# EAGLE design Power Distribution (EAGLE 8.3.2)
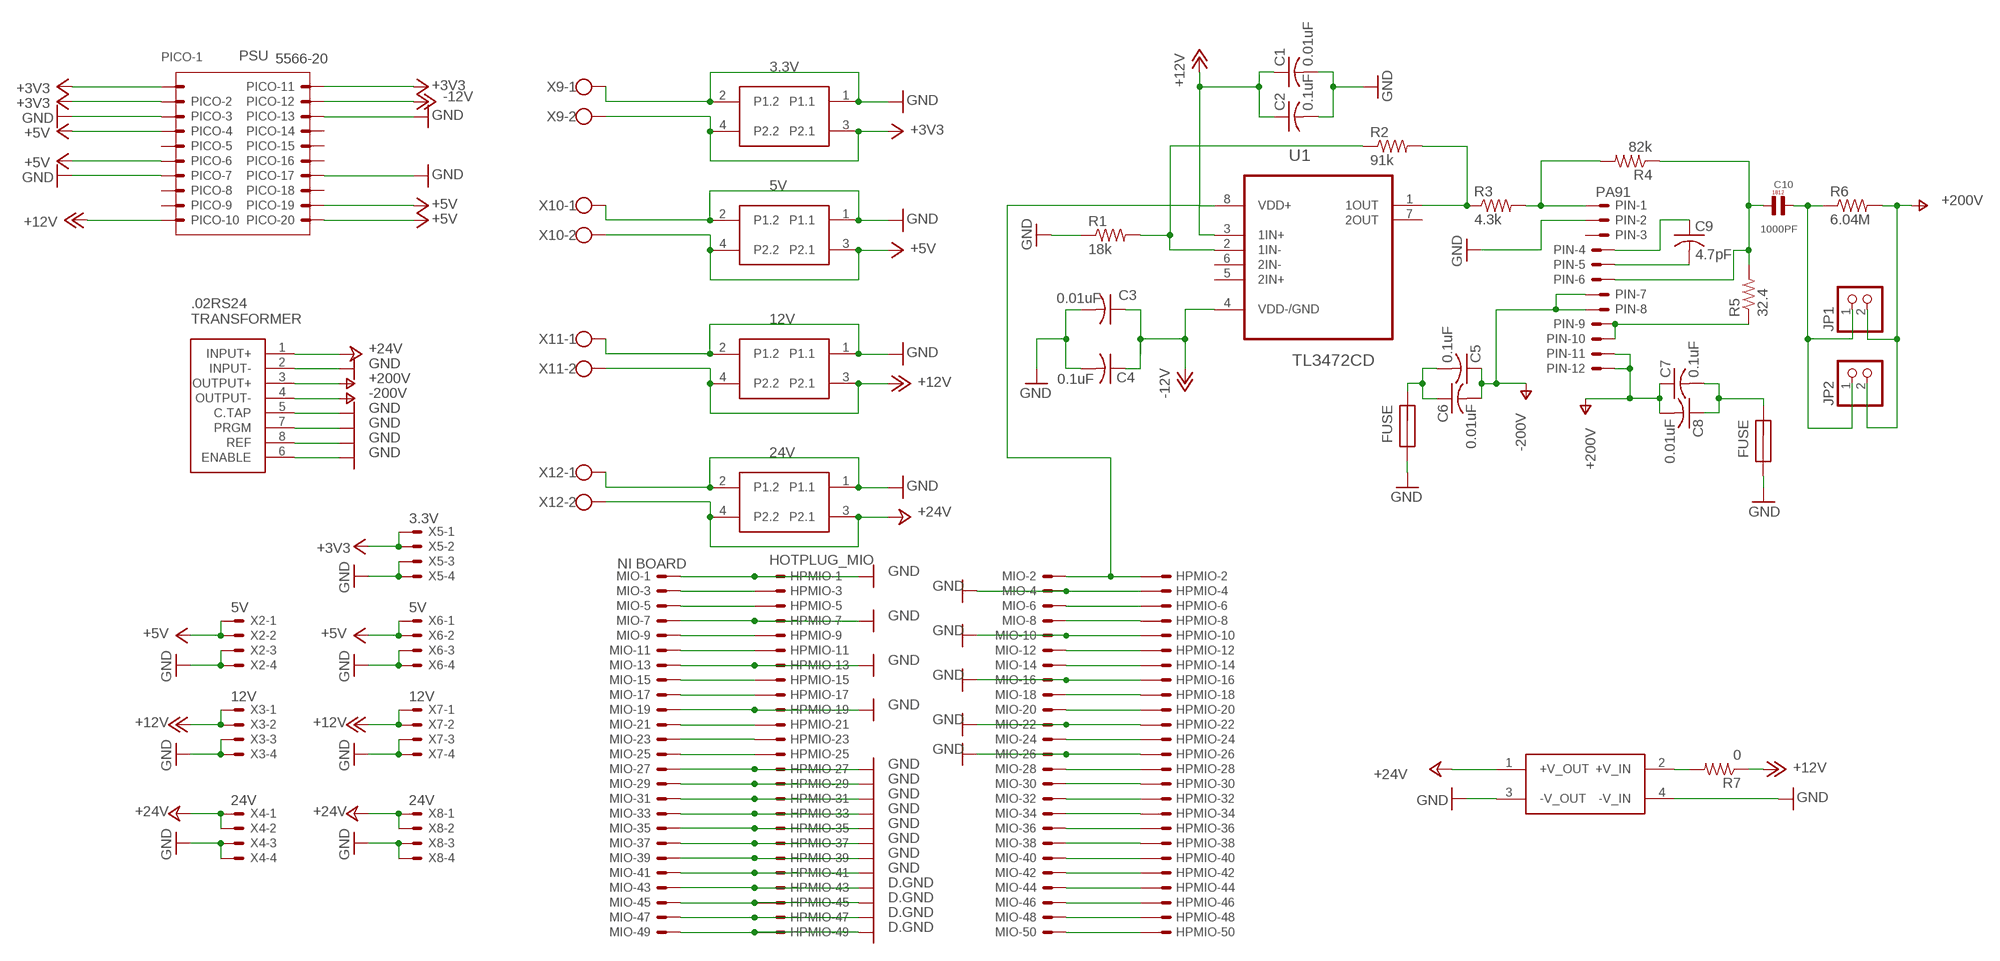
[diagram p0: schematic, sheet 1]

## Parts
$ZX1  12_DC-24_DC  [12_DC-24_DC]
C1  0.01uF  C-USC1206  [C1206]
C2  0.1uF  C-USC1206  [C1206]
C3  0.01uF  C-USC1206  [C1206]
C4  0.1uF  C-USC1206  [C1206]
C5  0.1uF  C-USC1206  [C1206]
C6  0.01uF  C-USC1206  [C1206]
C7  0.1uF  C-USC1206  [C1206]
C8  0.01uF  C-USC1206  [C1206]
C9  4.7pF  C-USC1206  [C1206]
C10  1000PF  [L4,8]
HPMIO  HOTPLUG_MIO  057-050-1  [057-050-1]
JP1  PINHD-1X2  [1X02]
JP2  PINHD-1X2  [1X02]
MIO  87758-5016  [87758-5016]
PICO  5566-20  [5566-20]
PIN  PA91  22-23-2121  [22-23-2121]
R1  18k  R-US_R1206  [R1206]
R2  91k  R-US_R1206  [R1206]
R3  4.3k  R-US_R1206  [R1206]
R4  82k  R-US_R1206  [R1206]
R5  32.4  R-US_R1206  [R1206]
R6  6.04M  R-US_R1206  [R1206]
R7  0  R-US_R1206  [R1206]
U1  TL3472CD  [SOIC127P600X175-8N]
U$1  .2RS24_TRANSFORMER  [0.2RS24_TRANSFORMER]
U$2  UXCELL_BLOCK_TERMINAL_RIGHT_ANGLE  [UXCELL_BLOCK_TERMINAL_RIGHT_ANGLE]
U$3  UXCELL_BLOCK_TERMINAL_RIGHT_ANGLE  [UXCELL_BLOCK_TERMINAL_RIGHT_ANGLE]
U$4  UXCELL_BLOCK_TERMINAL_RIGHT_ANGLE  [UXCELL_BLOCK_TERMINAL_RIGHT_ANGLE]
U$5  UXCELL_BLOCK_TERMINAL_RIGHT_ANGLE  [UXCELL_BLOCK_TERMINAL_RIGHT_ANGLE]
U$6  FUSE  [FUSE]
U$7  FUSE  [FUSE]
X2  5V  JST-XH-04-PIN-LONG-PAD  [JST-XH-04-PACKAGE-LONG-PAD]
X3  12V  JST-XH-04-PIN-LONG-PAD  [JST-XH-04-PACKAGE-LONG-PAD]
X4  24V  JST-XH-04-PIN-LONG-PAD  [JST-XH-04-PACKAGE-LONG-PAD]
X5  3.3V  JST-XH-04-PIN-LONG-PAD  [JST-XH-04-PACKAGE-LONG-PAD]
X6  5V  JST-XH-04-PIN-LONG-PAD  [JST-XH-04-PACKAGE-LONG-PAD]
X7  12V  JST-XH-04-PIN-LONG-PAD  [JST-XH-04-PACKAGE-LONG-PAD]
X8  24V  JST-XH-04-PIN-LONG-PAD  [JST-XH-04-PACKAGE-LONG-PAD]
X9  W237-102  [W237-102]
X10  W237-102  [W237-102]
X11  W237-102  [W237-102]
X12  W237-102  [W237-102]

## Nets
+3V3: PICO.1 PICO.2 PICO.11 U$5.3(P2.1) U$5.4(P2.2) X5.1 X5.2 X9.2
+5V: PICO.4 PICO.6 PICO.19 PICO.20 U$2.3(P2.1) U$2.4(P2.2) X2.1 X2.2 X6.1 X6.2 X10.2
+12V: C1.1 C2.1 PICO.10 R7.1 U1.8(VDD+) U$3.3(P2.1) U$3.4(P2.2) X3.1 X3.2 X7.1 X7.2 X11.2
+24V: $ZX1.1(+V_OUT) U$1.1(INPUT+) U$4.3(P2.1) U$4.4(P2.2) X4.1 X4.2 X8.1 X8.2 X12.2
-12V: C3.1 C4.1 PICO.12 U1.4(VDD-/GND)
GND: $ZX1.3(-V_OUT) $ZX1.4(-V_IN) C1.2 C2.2 C3.2 C4.2 HPMIO.1 HPMIO.4 HPMIO.7 HPMIO.10 HPMIO.13 HPMIO.16 HPMIO.19 HPMIO.22 HPMIO.26 HPMIO.27 HPMIO.29 HPMIO.31 HPMIO.33 HPMIO.35 HPMIO.37 HPMIO.39 HPMIO.41 HPMIO.43 HPMIO.45 HPMIO.47 HPMIO.49 MIO.1 MIO.4 MIO.7 MIO.10 MIO.13 MIO.16 MIO.19 MIO.22 MIO.26 MIO.27 MIO.29 MIO.31 MIO.33 MIO.35 MIO.37 MIO.39 MIO.41 MIO.43 MIO.45 MIO.47 MIO.49 PICO.3 PICO.7 PICO.13 PICO.17 PIN.2 R1.1 U$1.2(INPUT-) U$1.5(C.TAP) U$1.6(ENABLE) U$1.7(PRGM) U$1.8(REF) U$2.1(P1.1) U$2.2(P1.2) U$3.1(P1.1) U$3.2(P1.2) U$4.1(P1.1) U$4.2(P1.2) U$5.1(P1.1) U$5.2(P1.2) U$6.P$1 U$7.P$1 X2.3 X2.4 X3.3 X3.4 X4.3 X4.4 X5.3 X5.4 X6.3 X6.4 X7.3 X7.4 X8.3 X8.4 X9.1 X10.1 X11.1 X12.1 ; supply symbol labelled D.GND
N$1: $ZX1.2(+V_IN) R7.2
N$2: C5.2 C6.1 U$6.P$2
N$3: C7.2 C8.1 U$7.P$2
N$4: HPMIO.3 MIO.3
N$5: HPMIO.5 MIO.5
N$7: HPMIO.9 MIO.9
N$8: HPMIO.11 MIO.11
N$10: HPMIO.15 MIO.15
N$11: HPMIO.17 MIO.17
N$13: HPMIO.21 MIO.21
N$14: HPMIO.23 MIO.23
N$15: R1.2 R2.1 U1.2(1IN-)
N$21: R2.2 R3.1 U1.1(1OUT)
N$22: PIN.1 R3.2 R4.2
N$23: PIN.9 PIN.10 R5.1
N$24: C9.1 PIN.4
N$25: C9.2 PIN.5
N$26: C10.P$1 PIN.6 R4.1 R5.2
N$27: C10.P$2 JP1.1 JP2.1 R6.1
N$30: HPMIO.6 MIO.6
N$31: HPMIO.8 MIO.8
N$33: HPMIO.12 MIO.12
N$34: HPMIO.14 MIO.14
N$36: HPMIO.18 MIO.18
N$37: HPMIO.20 MIO.20
N$39: HPMIO.24 MIO.24
N$41: HPMIO.28 MIO.28
N$42: HPMIO.30 MIO.30
N$43: HPMIO.32 MIO.32
N$44: HPMIO.34 MIO.34
N$45: HPMIO.36 MIO.36
N$46: HPMIO.38 MIO.38
N$47: HPMIO.40 MIO.40
N$48: HPMIO.42 MIO.42
N$49: HPMIO.44 MIO.44
N$50: HPMIO.46 MIO.46
N$51: HPMIO.48 MIO.48
N$52: HPMIO.50 MIO.50
N$61: HPMIO.25 MIO.25
V+: C7.1 C8.2 JP1.2 JP2.2 PIN.11 PIN.12 R6.2 U$1.3(OUTPUT+) ; supply symbol labelled +200V
V-: C5.1 C6.2 PIN.7 PIN.8 U$1.4(OUTPUT-) ; supply symbol labelled -200V
VIN: HPMIO.2 MIO.2 U1.3(1IN+)
Unconnected: PICO.5 PICO.8 PICO.9 PICO.14 PICO.15 PICO.16 PICO.18 PIN.3 U1.5(2IN+) U1.6(2IN-) U1.7(2OUT)

## Notes on the sheet
- PSU
- 3.3V
- 5V
- 12V
- 24V
- NI BOARD

## Library data of the parts
$ZX1 = Lucas Library:12_DC-24_DC
C1 C3 C6 C8 = resistor:C-US: CAPACITOR, American symbol; MF: KEMET; MPN: C0805C103K1RACTU; OC_FARNELL: 1414661
C2 C4 C5 C7 = resistor:C-US: CAPACITOR, American symbol; MF: AVX; MPN: 08055C104KAT2A; OC_FARNELL: 499687
C9 = resistor:C-US: CAPACITOR, American symbol; MF: KEMET; MPN: C0805C479C5GACTU; OC_FARNELL: 1800809
C10 = Capacitor-Wima-SMD1812-250v:1000PF
HPMIO = con-panduit:057-050-: CONNECTOR 50-pin series 057 contact pc board low profile headers; OC_FARNELL: unknown; OC_NEWARK: unknown
JP1 JP2 = pinhead:PINHD-1X2: PIN HEADER
MIO = con-molex:87758-5016: 50 Pin - 2mm Dual Row Single Wafer, Vertical T/H HDR Source: http://www.molex.com/pdm_docs/sd/877580616_sd.pdf; MF: MOLEX; MPN: 87758-5016; OC_FARNELL: 7472382; OC_NEWARK: 59J1592
PICO = con-molex:5566-20: Mini FIT connector 20 pol ATX PC-Motherboard Power connector Source: http://www.molex.com; OC_FARNELL: unknown; OC_NEWARK: unknown
PIN = con-molex:22-23-2121: .100" (2.54mm) Center Header - 12 Pin; OC_FARNELL: unknown; OC_NEWARK: 56H0456
R1 R7 = resistor:R-US_: RESISTOR, American symbol; MF: WELWYN; MPN: WCR0805-18KFI; OC_FARNELL: 1100322
R2 = resistor:R-US_: RESISTOR, American symbol; MF: KOA SPEAR ELECTRONICS; MPN: SG73S2ATTD9102F; OC_FARNELL: 1400374
R3 = resistor:R-US_: RESISTOR, American symbol; MF: VISHAY; MPN: CRCW08054K30FKEA; OC_FARNELL: 1152372
R4 = resistor:R-US_: RESISTOR, American symbol; MF: WELWYN; MPN: WCR0805-82KFI; OC_FARNELL: 1100327
R5 = resistor:R-US_: RESISTOR, American symbol; MF: TE CONNECTIVITY; MPN: RN73C2A32K4BTDF; OC_FARNELL: 1140967
R6 = resistor:R-US_: RESISTOR, American symbol; MF: VISHAY; MPN: CRCW08056M04FKEA.; OC_FARNELL: 2123607
U1 = TL3472CD:TL3472CD: HIGH-SLEW-RATE, SINGLE-SUPPLY OPERATIONAL AMPLIFIER; AVAILABILITY: Good; DESCRIPTION: High-Slew- ate, Single-Supply Operational Amplifier 8-SOIC 0 to 70; MF: Texas Instruments; MP: TL3472CD; OC_FARNELL: unknown; PACKAGE: SOIC-8 Texas Instruments; PRICE: 0.47 USD
U$1 = Lucas Library:.2RS24_TRANSFORMER
U$2-U$5 = Lucas Library:UXCELL_BLOCK_TERMINAL_RIGHT_ANGLE: UXCELL_BLOCK_TERMINAL AUTHOR: LUCAS MUN Spring retensioned block terminal. Pin sets are notated by following: P$.#. $ = pin set, # pin number within the pin set.Pin 1 is the top left pin while input connections are on the left side within bottom view.
U$6 U$7 = Lucas Library:FUSE
X2-X8 = JST XH Connectors v1-0:JST-XH-04-PIN: JST XH Connector 2 Pin Wire to board connector. Pitch: 2,54 mm, (0.100") Number of pins: 4 Created by Rembrandt Electronics www.rembrandtelectronics.com
X9-X12 = con-wago-500:W237-102: WAGO SCREW CLAMP; MPN: 237-102; OC_FARNELL: unknown; OC_NEWARK: 70K9898

## Board
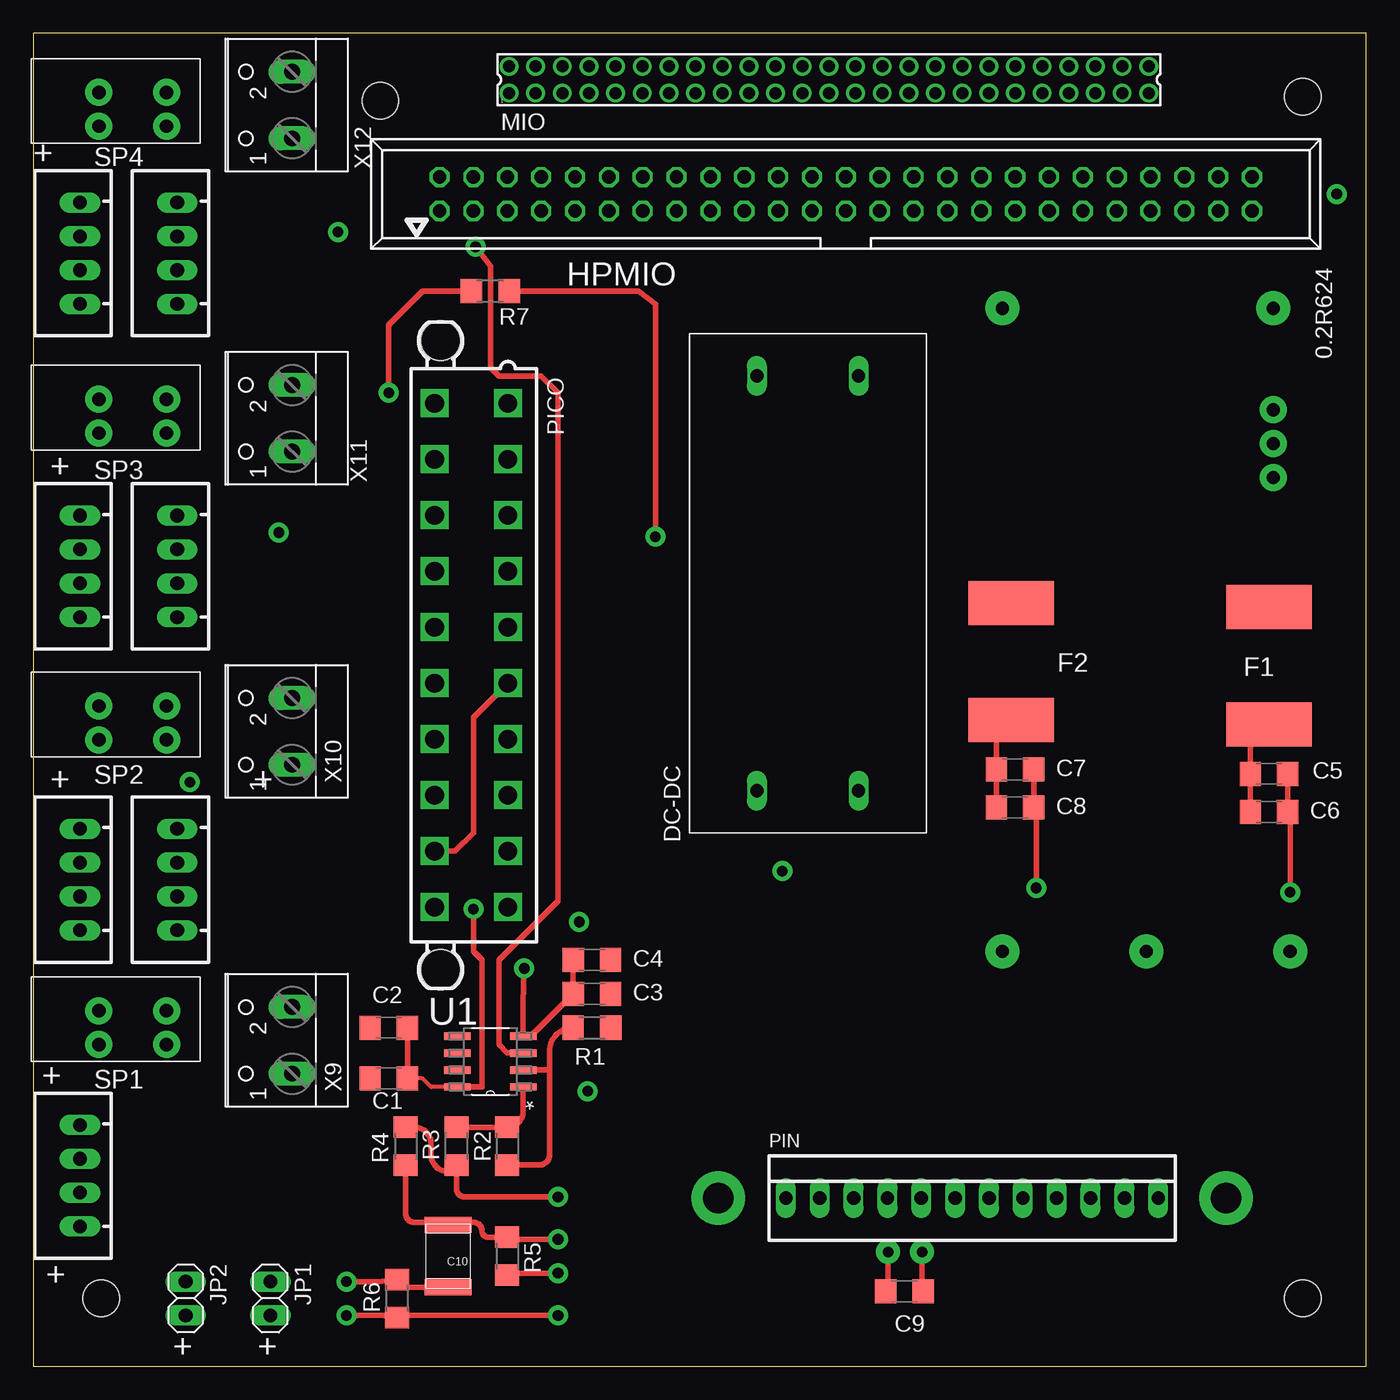
[diagram p1: board, top side]
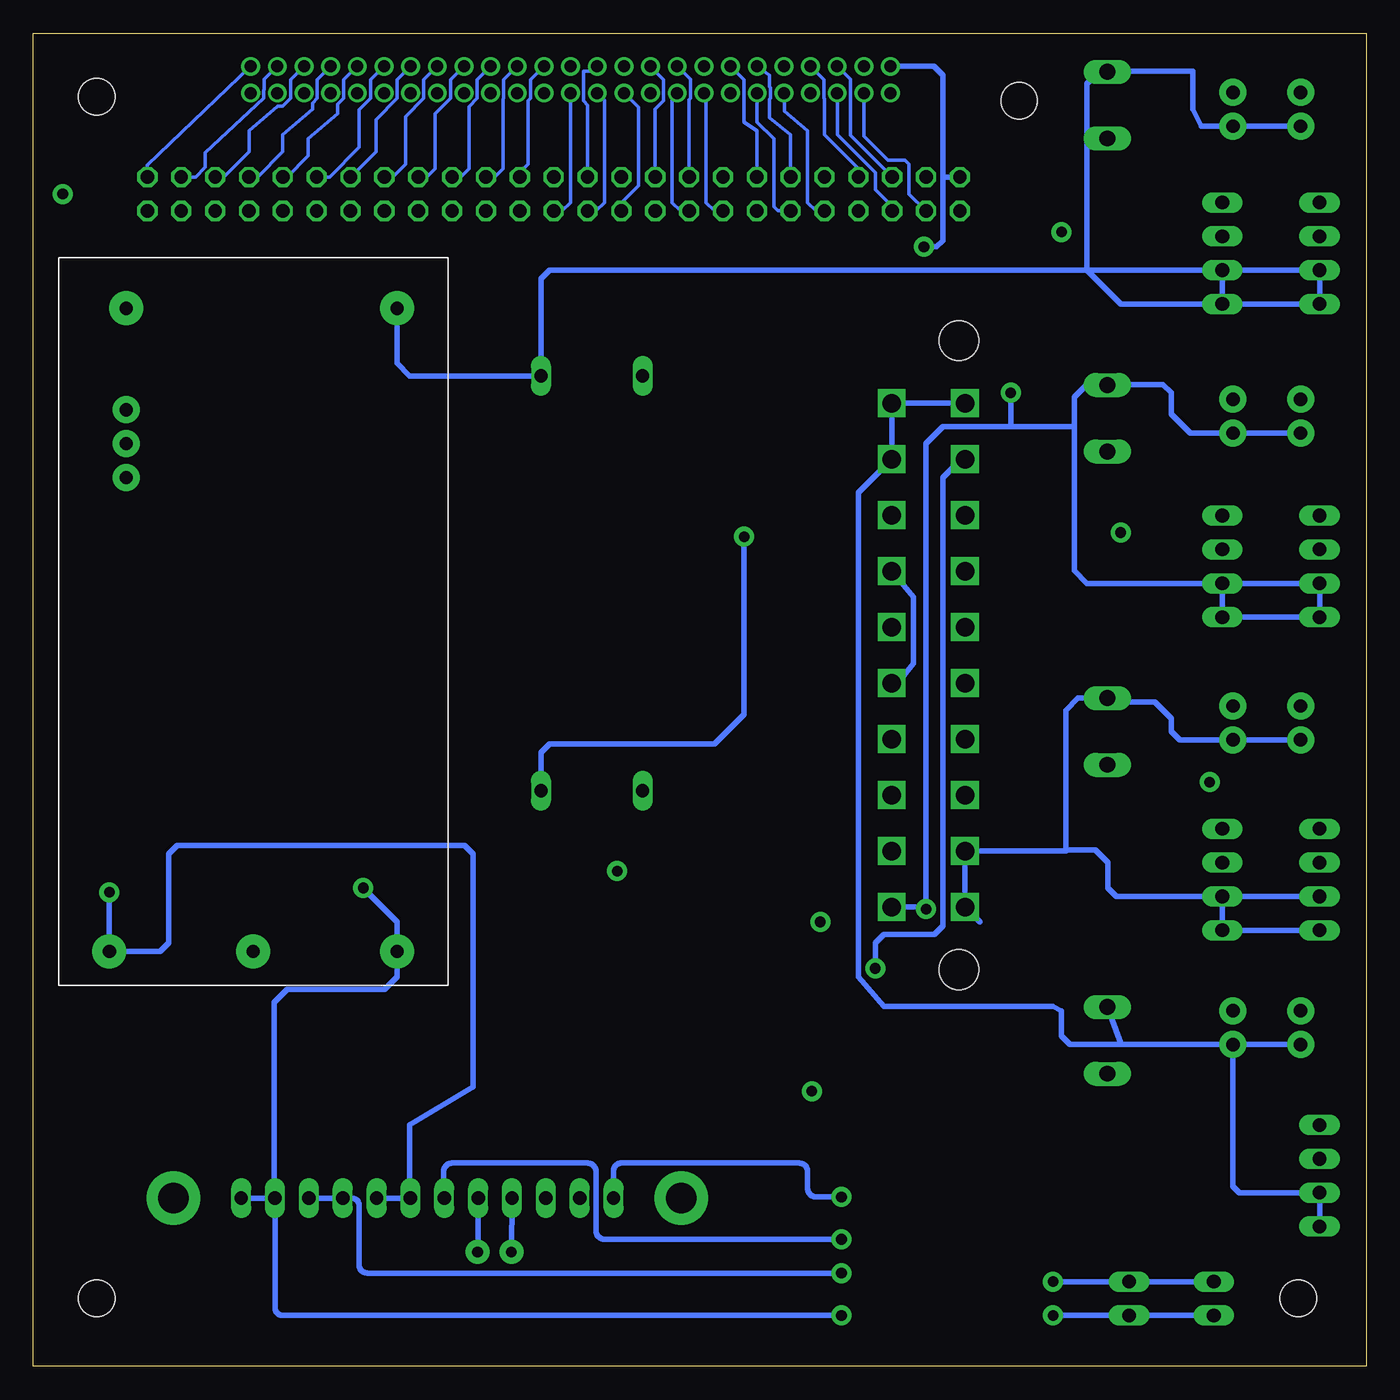
[diagram p2: board, bottom side, seen from below]

Size 100 x 100 mm. Coordinates in mm from the lower left corner, seen from the top.
Outline: 0,0 100,0 100,100 0,100 0,0
Copper layers (1*16): Top 0.035mm / dielectric 1.5mm / Bottom 0.035mm
Design rules "default *": minimum track width 6mil, minimum drill 0.35mm, track to track 6mil, track to pad 6mil, pad to pad 6mil, via to via 6mil, smd to smd 6mil, copper to edge 40mil, drill to drill 6mil, minimum pad ring 10mil, minimum via ring 8mil, stop-mask expansion 4mil, vias tented up to drill 0mil, thermal gap 10mil
Holes 2.75 mm at 5.08,5.08 95.25,5.08 95.25,95.25
Holes 2.74 mm at 26.04,94.93

### Footprints (pad centres in the part's own frame; a part is rotated, then mirrored left to right if it is on the bottom)
12_DC-24_DC = drill 1 long: 1 -15.875,3.81; 2 15.24,3.81; 3 -15.875,-3.81; 4 15.24,-3.81
C1206 = smd 1.6 x 1.8: 1 -1.4,0; 2 1.4,0
L4,8 = smd 3.5 x 1.2: P$1 0,-2.35; P$2 0,2.35
057-050-1 = drill 1 octagon: 1 -30.48,-1.27; 2 -30.48,1.27; 3 -27.94,-1.27; 4 -27.94,1.27; 5 -25.4,-1.27; 6 -25.4,1.27; 7 -22.86,-1.27; 8 -22.86,1.27; 9 -20.32,-1.27; 10 -20.32,1.27; 11 -17.78,-1.27; 12 -17.78,1.27; 13 -15.24,-1.27; 14 -15.24,1.27; 15 -12.7,-1.27; 16 -12.7,1.27; 17 -10.16,-1.27; 18 -10.16,1.27; 19 -7.62,-1.27; 20 -7.62,1.27; 21 -5.08,-1.27; 22 -5.08,1.27; 23 -2.54,-1.27; 24 -2.54,1.27; 25 0,-1.27; 26 0,1.27; 27 2.54,-1.27; 28 2.54,1.27; 29 5.08,-1.27; 30 5.08,1.27; 31 7.62,-1.27; 32 7.62,1.27; 33 10.16,-1.27; 34 10.16,1.27; 35 12.7,-1.27; 36 12.7,1.27; 37 15.24,-1.27; 38 15.24,1.27; 39 17.78,-1.27; 40 17.78,1.27; 41 20.32,-1.27; 42 20.32,1.27; 43 22.86,-1.27; 44 22.86,1.27; 45 25.4,-1.27; 46 25.4,1.27; 47 27.94,-1.27; 48 27.94,1.27; 49 30.48,-1.27; 50 30.48,1.27
1X02 = drill 1.016 long: 1 -1.27,0; 2 1.27,0
87758-5016 = drill 0.9 pad 1.27: 1 -24,-1; 2 -24,1; 3 -22,-1; 4 -22,1; 5 -20,-1; 6 -20,1; 7 -18,-1; 8 -18,1; 9 -16,-1; 10 -16,1; 11 -14,-1; 12 -14,1; 13 -12,-1; 14 -12,1; 15 -10,-1; 16 -10,1; 17 -8,-1; 18 -8,1; 19 -6,-1; 20 -6,1; 21 -4,-1; 22 -4,1; 23 -2,-1; 24 -2,1; 25 0,-1; 26 0,1; 27 2,-1; 28 2,1; 29 4,-1; 30 4,1; 31 6,-1; 32 6,1; 33 8,-1; 34 8,1; 35 10,-1; 36 10,1; 37 12,-1; 38 12,1; 39 14,-1; 40 14,1; 41 16,-1; 42 16,1; 43 18,-1; 44 18,1; 45 20,-1; 46 20,1; 47 22,-1; 48 22,1; 49 24,-1; 50 24,1
5566-20 = drill 1.4 square: 1 18.9,-2.75; 2 14.7,-2.75; 3 10.5,-2.75; 4 6.3,-2.75; 5 2.1,-2.75; 6 -2.1,-2.75; 7 -6.3,-2.75; 8 -10.5,-2.75; 9 -14.7,-2.75; 10 -18.9,-2.75; 11 18.9,2.75; 12 14.7,2.75; 13 10.5,2.75; 14 6.3,2.75; 15 2.1,2.75; 16 -2.1,2.75; 17 -6.3,2.75; 18 -10.5,2.75; 19 -14.7,2.75; 20 -18.9,2.75 | hole 3: 23.6,2.29; -23.6,2.29
22-23-2121 = drill 1 long: 1 -13.97,0; 2 -11.43,0; 3 -8.89,0; 4 -6.35,0; 5 -3.81,0; 6 -1.27,0; 7 1.27,0; 8 3.81,0; 9 6.35,0; 10 8.89,0; 11 11.43,0; 12 13.97,0
R1206 = smd 1.6 x 1.803: 1 -1.422,0; 2 1.422,0
SOIC127P600X175-8N = smd 1.981 x 0.559: 1 -2.464,1.905; 2 -2.464,0.635; 3 -2.464,-0.635; 4 -2.464,-1.905; 5 2.464,-1.905; 6 2.464,-0.635; 7 2.464,0.635; 8 2.464,1.905
0.2RS24_TRANSFORMER = drill 1 pad 2.54: 1 25.4,12.065; 2 25.4,-8.255; 3 -22.86,12.065; 4 -22.86,-9.525; 5 -22.86,1.27 | drill 1 pad 2.032: 6 17.78,-8.255; 7 15.24,-8.255; 8 12.7,-8.255
UXCELL_BLOCK_TERMINAL_RIGHT_ANGLE = drill 1 pad 2.032: 1 -1.27,1.27; 2 3.81,1.27; 3 -1.27,-1.27; 4 3.81,-1.27
FUSE = smd 3.251 x 6.452: P$1 0.2,1.6; P$2 9,1.6
JST-XH-04-PACKAGE-LONG-PAD = drill 1.016 long: 1 -3.81,0; 2 -1.27,0; 3 1.27,0; 4 3.81,0
W237-102 = drill 1.194 long: 1 -2.5,-1.27; 2 2.5,-1.27

### Placement (x,y rotation side)
$ZX1  58.1,58.42 270 top
C1  26.67,21.59 180 top
C2  26.67,25.4 180 top
C3  41.91,27.94 0 top
C4  41.91,30.48 0 top
C5  92.71,44.45 180 top
C6  92.71,41.59 0 top
C7  73.66,44.77 180 top
C8  73.66,41.91 0 top
C9  65.35,5.62 0 top
C10  31.11,8.26 180 top
HPMIO  60.96,87.95 0 top
JP1  17.78,5.08 270 top
JP2  11.43,5.08 270 top
MIO  59.69,96.52 0 top
PICO  32.85,53.34 90 top
PIN  70.43,12.61 0 top
R1  41.91,25.4 180 top
R2  35.56,16.51 90 top
R3  31.75,16.51 270 top
R4  27.94,16.51 90 top
R5  35.56,8.26 90 top
R6  27.3,5.08 270 top
R7  34.29,80.64 0 top
U1  34.29,22.86 180 top
U$1  84.77,53.98 90 top
U$2  6.18,48.26 0 top
U$3  6.18,71.28 0 top
U$4  6.18,94.3 0 top
U$5  6.18,25.4 0 top
U$6  91.12,57.15 270 top
U$7  71.75,57.47 270 top
X2  3.49,36.51 90 top
X3  3.49,60.01 90 top
X4  10.79,83.5 90 top
X5  3.49,14.29 90 top
X6  10.79,36.51 90 top
X7  10.79,60.01 90 top
X8  3.49,83.5 90 top
X9  18.14,24.45 90 top
X10  18.14,47.62 90 top
X11  18.14,71.12 90 top
X12  18.14,94.61 90 top

### Tracks (layer width: path | path; a pad name or v marks a point on that pad's centre or on a via)
+3V3
  Bottom 0.4: PICO.11 PICO.1 PICO.2 38.1,65.54 38.1,29.21 36.2,26.99 23.5,26.99 22.86,26.67 22.86,24.77 22.23,24.13 18.52,24.13 | U$5.3 U$5.4 | U$5.4 18.52,24.13 | X9.2 18.41,24.23 18.52,24.13 | U$5.4 9.99,13.49 9.53,13.02 X5.2 X5.1
+5V
  Top 0.4: PICO.19 31.66,38.64 33.02,40.01 33.02,48.66 PICO.6
  Bottom 0.4: U$2.3 U$2.4 13.97,46.99 14.61,47.62 14.61,48.58 15.88,49.85 18.14,49.85 X10.2 21.63,50.12 22.54,49.21 22.54,38.64 | 29,33.34 PICO.20 PICO.19 22.54,38.64 | PICO.4 33.97,57.7 33.97,52.7 35.12,51.24 PICO.6 | 10.48,35.24 X2.2 | 10.48,35.24 X6.2 18.73,35.24 19.37,35.88 19.37,37.78 20.32,38.73 22.45,38.73 22.54,38.64 | X2.1 X6.1 10.79,34.92 10.48,35.24
+12V  (via drill 0.8 pad 1.5)
  Top 0.3: U1.8 29.84,20.95 29.21,21.59 C1.1
  Top 0.4: U1.8 33.66,20.95 33.66,30.48 33.28,30.86 33.02,31.12 v33.02,34.29 | C1.1 C2.1 | v26.67,73.03 26.67,78.11 29.21,80.64 R7.1
  Bottom 0.4: 26.67,70.48 31.75,70.48 33.02,69.22 v33.02,34.29 33.17,34.44 PICO.10 | 26.67,70.48 v26.67,73.03 | U$3.3 U$3.4 13.18,70.01 14.61,71.44 14.61,73.03 15.24,73.66 18.38,73.66 X11.2 21,73.62 21.91,72.71 21.91,70.48 | X7.2 X3.2 X3.1 X7.1 X7.2 | 21.91,70.48 21.91,59.69 20.95,58.74 X7.2 | 26.67,70.48 21.91,70.48
+24V
  Bottom 0.4: U$4.3 U$4.4 12.38,93.03 13.02,94.3 13.02,97.16 18.38,97.16 X12.2 20.04,97.11 20.95,96.2 20.95,82.23 | X4.1 10.82,79.69 | 10.82,79.69 18.41,79.69 20.95,82.23 | 20.95,82.23 X4.2 | U$1.1 72.71,75.25 71.75,74.3 $ZX1.1 61.91,81.6 61.28,82.23 20.95,82.23 | X4.1 X8.1 X8.2 X4.2 | X4.1 10.82,79.69 | X4.2 X4.1
-12V  (via drill 0.8 pad 1.5)
  Top 0.4: v36.83,29.84 36.75,27.23 U1.4 37.34,24.77 C3.1 C4.1
  Bottom 0.4: PICO.12 30.39,68.04 31.75,66.67 31.75,33.02 32.38,32.38 36.2,32.38 36.83,31.75 v36.83,29.84
GND  (via drill 0.8 pad 1.5, 2.29 pad 4)
  other vias: 22.86,85.09 97.79,87.95 18.41,62.55 11.75,43.81 41.59,20.64 56.2,37.15 51.38,12.61 89.48,12.61
N$1  (via drill 0.8 pad 1.5)
  Top 0.4: R7.2 45.4,80.64 46.67,79.69 v46.67,62.23
  Bottom 0.4: v46.67,62.23 46.67,48.9 48.9,46.67 61.28,46.67 61.91,46.04 $ZX1.2
N$2
  Top 0.4: 92.61,48.04 91.31,46.74 | 92.61,48.04 U$6.P$2 92.15,48.15 91.31,47.31 | C6.1 C5.2 91.31,46.35 | 91.31,47.31 91.31,46.35 | 91.31,47.31 91.31,47.49 91.44,47.62 | 91.31,46.35 91.31,46.74 | 91.31,46.74 92.61,48.04
N$3
  Top 0.4: 72.07,47.94 72.26,47.76 | 72.07,47.94 72.83,47.94 U$7.P$2 | C8.1 C7.2 72.26,47.76 | 72.26,47.76 72.07,47.94
N$4
  Bottom 0.25: HPMIO.3 34.29,87.95 34.29,90.17 34.61,90.49 35.88,90.49 37.69,92.3 MIO.3
N$5
  Bottom 0.25: HPMIO.5 35.56,87 36.83,88.27 36.83,89.53 39.69,92.39 MIO.5
N$7
  Bottom 0.25: HPMIO.9 41.27,86.68 41.91,87.31 41.91,92.71 43.66,94.14 MIO.9
N$8
  Bottom 0.25: 43.81,86.68 HPMIO.11 44.13,86.68 44.45,87 44.45,92.08 45.72,93.34 45.72,94.54 MIO.11
N$10
  Bottom 0.25: HPMIO.15 48.9,86.68 49.53,87.31 49.53,95.36 MIO.15
N$11
  Bottom 0.25: HPMIO.17 51.44,86.68 52.07,87.31 52.07,95.14 MIO.17
N$13
  Bottom 0.25: HPMIO.21 55.88,87.31 54.61,88.58 54.61,94.44 MIO.21
N$14
  Bottom 0.25: HPMIO.23 57.78,86.68 57.15,87.31 57.15,94.98 MIO.23
N$15
  Top 0.4: 38.73,22.23 U1.2 | 38.73,22.23 38.73,23.65 arc-90 R1.2 | R2.1 37.95,15.09 arc90 38.73,15.88 38.73,22.23
N$17  (via drill 0.8 pad 1.5)
  other vias: 40.96,33.34
N$21
  Top 0.4: R3.1 R2.2 arc90 36.75,19.13 U1.1
N$22  (via drill 0.8 pad 1.5)
  Top 0.3: 28.57,17.93 R4.2 | 31.75,14.61 31.11,14.61
  Top 0.4: 31.75,14.61 R3.2 31.75,13.34 arc90 32.38,12.7 v39.37,12.7 | 28.57,17.93 arc-90 29.84,16.66 29.84,15.88 arc90 31.11,14.61
  Bottom 0.4: v39.37,12.7 41.27,12.7 arc90 41.91,13.34 41.91,14.61 arc-90 42.55,15.24 55.88,15.24 arc-90 56.46,14.66 PIN.1
N$23  (via drill 0.8 pad 1.5)
  Top 0.4: v39.37,6.99 35.71,6.99 arc90 R5.1
  Bottom 0.4: PIN.10 PIN.9 76.11,12.61 arc90 75.56,12.06 75.56,7.62 arc-90 74.93,6.99 v39.37,6.99
N$24  (via drill 0.8 pad 1.8)
  Top 0.4: v64.14,8.57 64.14,5.8 C9.1
  Bottom 0.4: PIN.4 v64.14,8.57
N$25  (via drill 0.8 pad 1.8)
  Top 0.4: v66.67,8.57 66.67,5.7 C9.2
  Bottom 0.4: PIN.5 66.62,8.62 v66.67,8.57
N$26  (via drill 0.8 pad 1.5)
  Top 0.4: R4.1 27.94,11.43 arc90 28.57,10.79 30.93,10.79 arc-90 C10.P$1 arc-90 31.3,10.79 33.02,10.79 arc-90 33.66,10.16 arc90 34.14,9.68 R5.2 arc90 35.71,9.53 v39.37,9.53
  Bottom 0.4: PIN.6 69.22,14.61 arc90 68.58,15.24 58.42,15.24 arc90 57.78,14.61 57.78,10.16 arc-90 57.15,9.53 v39.37,9.53
N$27  (via drill 0.8 pad 1.5)
  Top 0.4: C10.P$2 26.63,5.91 arc-90 R6.1 25.88,6.35 v23.5,6.35
  Bottom 0.4: v23.5,6.35 JP1.1 JP2.1
N$30
  Bottom 0.25: HPMIO.6 38.71,92.37 38.71,96.54 MIO.6
N$31
  Bottom 0.25: HPMIO.8 38.1,89.85 40.64,92.39 40.64,95.08 40.67,95.11 40.67,96.5 MIO.8
N$33
  Bottom 0.25: MIO.12 44.77,96.84 44.77,95.98 44.71,95.93 44.71,95.11 44.77,95.06 44.77,93.66 43.18,92.39 HPMIO.12
N$34
  Bottom 0.25: MIO.14 46.67,96.5 46.67,93.34 45.72,92.71 HPMIO.14
N$36
  Bottom 0.25: HPMIO.18 50.8,95.02 50.71,95.11 50.71,96.54 MIO.18
N$37
  Bottom 0.25: HPMIO.20 53.34,94.3 52.7,94.93 52.7,96.53 MIO.20
N$39
  Bottom 0.25: HPMIO.24 58.42,94.61 58.74,94.93 58.74,95.08 58.71,95.11 58.71,97.16 58.05,97.16 MIO.24
N$41
  Bottom 0.25: HPMIO.28 63.5,89.53 62.87,90.17 62.87,94.96 62.71,95.11 62.71,96.5 MIO.28
N$42
  Bottom 0.25: HPMIO.30 65.41,89.22 64.77,89.85 64.77,95.05 64.71,95.11 64.71,96.5 MIO.30
N$43
  Bottom 0.25: HPMIO.32 67.94,89.22 67.31,89.85 67.31,94.51 66.71,95.11 66.71,96.5 MIO.32
N$44
  Bottom 0.25: HPMIO.34 70.48,89.22 69.85,89.85 69.85,93.97 68.71,95.11 68.71,96.5 MIO.34
N$45
  Bottom 0.25: HPMIO.36 73.03,89.22 72.07,90.17 72.07,93.75 70.71,95.11 70.71,96.5 MIO.36
N$46
  Bottom 0.25: HPMIO.38 74.3,91.12 74.3,93.53 72.71,95.11 72.71,96.5 MIO.38
N$47
  Bottom 0.25: HPMIO.40 77.79,89.22 75.56,91.44 75.56,94.26 74.71,95.11 74.71,96.5 MIO.40
N$48
  Bottom 0.25: HPMIO.42 80.96,89.22 79.38,90.81 79.38,92.08 77.15,93.98 77.15,94.67 76.71,95.11 76.71,96.5 MIO.42
N$49
  Bottom 0.25: HPMIO.44 83.19,89.22 81.28,91.12 81.28,92.39 79.06,94.3 79.06,94.77 78.71,95.11 78.71,96.5 MIO.44
N$50
  Bottom 0.25: HPMIO.46 85.72,89.22 83.82,91.12 83.82,92.71 81.67,94.54 81.28,94.54 80.71,95.11 80.71,96.5 MIO.46
N$51
  Bottom 0.25: HPMIO.48 87.82,89.22 87.09,89.95 87.09,91.05 82.71,95.11 82.71,95.73 82.67,95.76 82.67,96.54 MIO.48
N$52
  Bottom 0.25: HPMIO.50 91.44,90.09 MIO.50
N$61
  Bottom 0.25: HPMIO.25 60.33,86.68 59.69,87.31 MIO.25
V+  (via drill 0.8 pad 1.5)
  Top 0.4: 26.04,3.81 v39.37,3.81 | v23.5,3.81 26.04,3.81 | 26.04,3.81 R6.2 | C7.1 C8.2 75.25,41.72 v75.25,35.88
  Bottom 0.4: PIN.11 81.86,12.38 | 81.86,12.38 81.86,4.39 arc-90 81.28,3.81 v39.37,3.81 | PIN.12 PIN.11 | v75.25,35.88 72.71,33.34 U$1.3 72.71,29.21 73.66,28.26 80.96,28.26 81.92,27.3 81.92,12.66 PIN.11 | 81.92,12.43 81.86,12.38 | v23.5,3.81 JP1.2 JP2.2
V-  (via drill 0.8 pad 1.5)
  Top 0.4: C5.1 C6.2 94.3,41.41 v94.3,35.56
  Bottom 0.4: PIN.8 PIN.7 71.75,12.66 71.75,18.1 66.99,20.95 66.99,38.42 67.63,39.05 89.22,39.05 89.85,38.42 89.85,31.75 90.49,31.11 U$1.4 v94.3,35.56
VIN  (via drill 0.8 pad 1.5)
  Top 0.4: U1.3 35.56,23.5 34.92,24.13 34.92,30.48 39.37,34.92 39.37,73.03 38.1,74.3 34.92,74.3 34.29,74.93 34.29,82.55 v33.18,83.98
  Bottom 0.4: v33.18,83.98 32.23,83.98 31.75,84.45 31.75,89.22 | 31.11,89.22 HPMIO.2 31.75,89.22 | MIO.2 32.43,97.52 31.75,96.84 31.75,89.22

### Text on the board
tPlace: F2 | F1
tNames: SP4 | + | SP3 | + | SP2 | + | + | SP1 | + | + | + | +
tSilk: DC_BLOCK | 24V | +OUT | +IN | -OUT | - IN | DANGER / HIGH VOLTAGE | 12V | 5V | 3.3V | DANGER / HIGH VOLTAGE